# Altium schematic sheet variantes_dton.SchDoc
size 88 x 114 mm
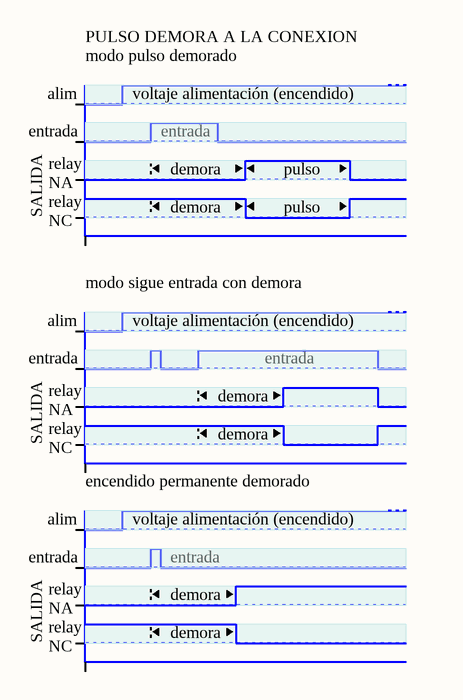
[diagram p0: variantes_dton.SchDoc]

## Notes on the sheet
- PULSO DEMORA A LA CONEXION
- modo pulso demorado
- entrada
- alim
- voltaje alimentación (encendido)
- demora
- pulso
- relay
  NA
- relay
  NC
- SALIDA
- modo sigue entrada con demora
- encendido permanente demorado